# EasyEDA Pro project lune-v6-rev3.2.eprj, schematic lune-v6-rev3.2

## Sheets
1 Connectors: Board Name: lune-v6-rev3.2; Create Date: 2026-08-11; Page Name: Connectors; Project Name: lune-v6-rev3.2; Schematic Name: lune-v6-rev3.2; Update Date: 2026-08-26; Company: EasyEDA.com; Page Size: A4; Version: V1.0
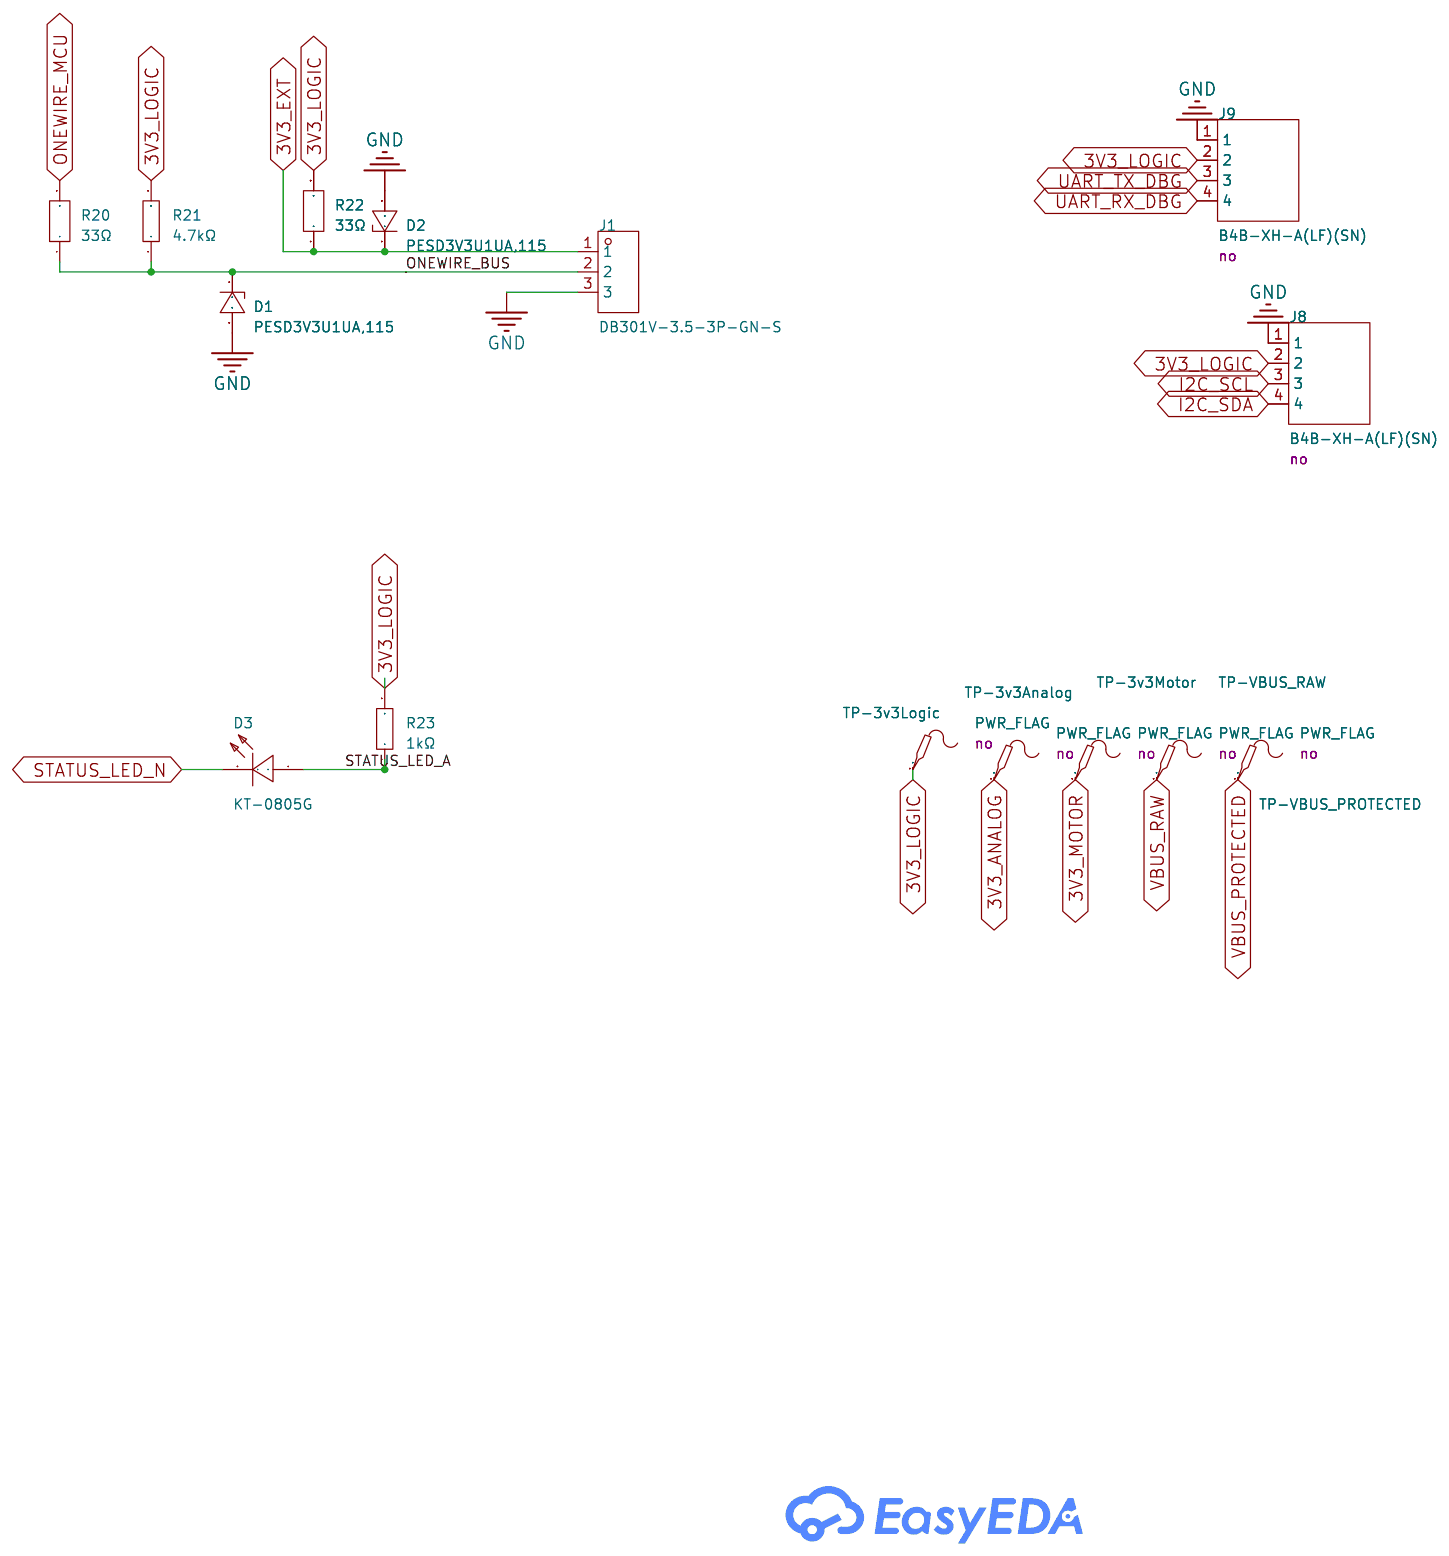
[diagram p0: Connectors]
2 Controller: Page Name: Controller
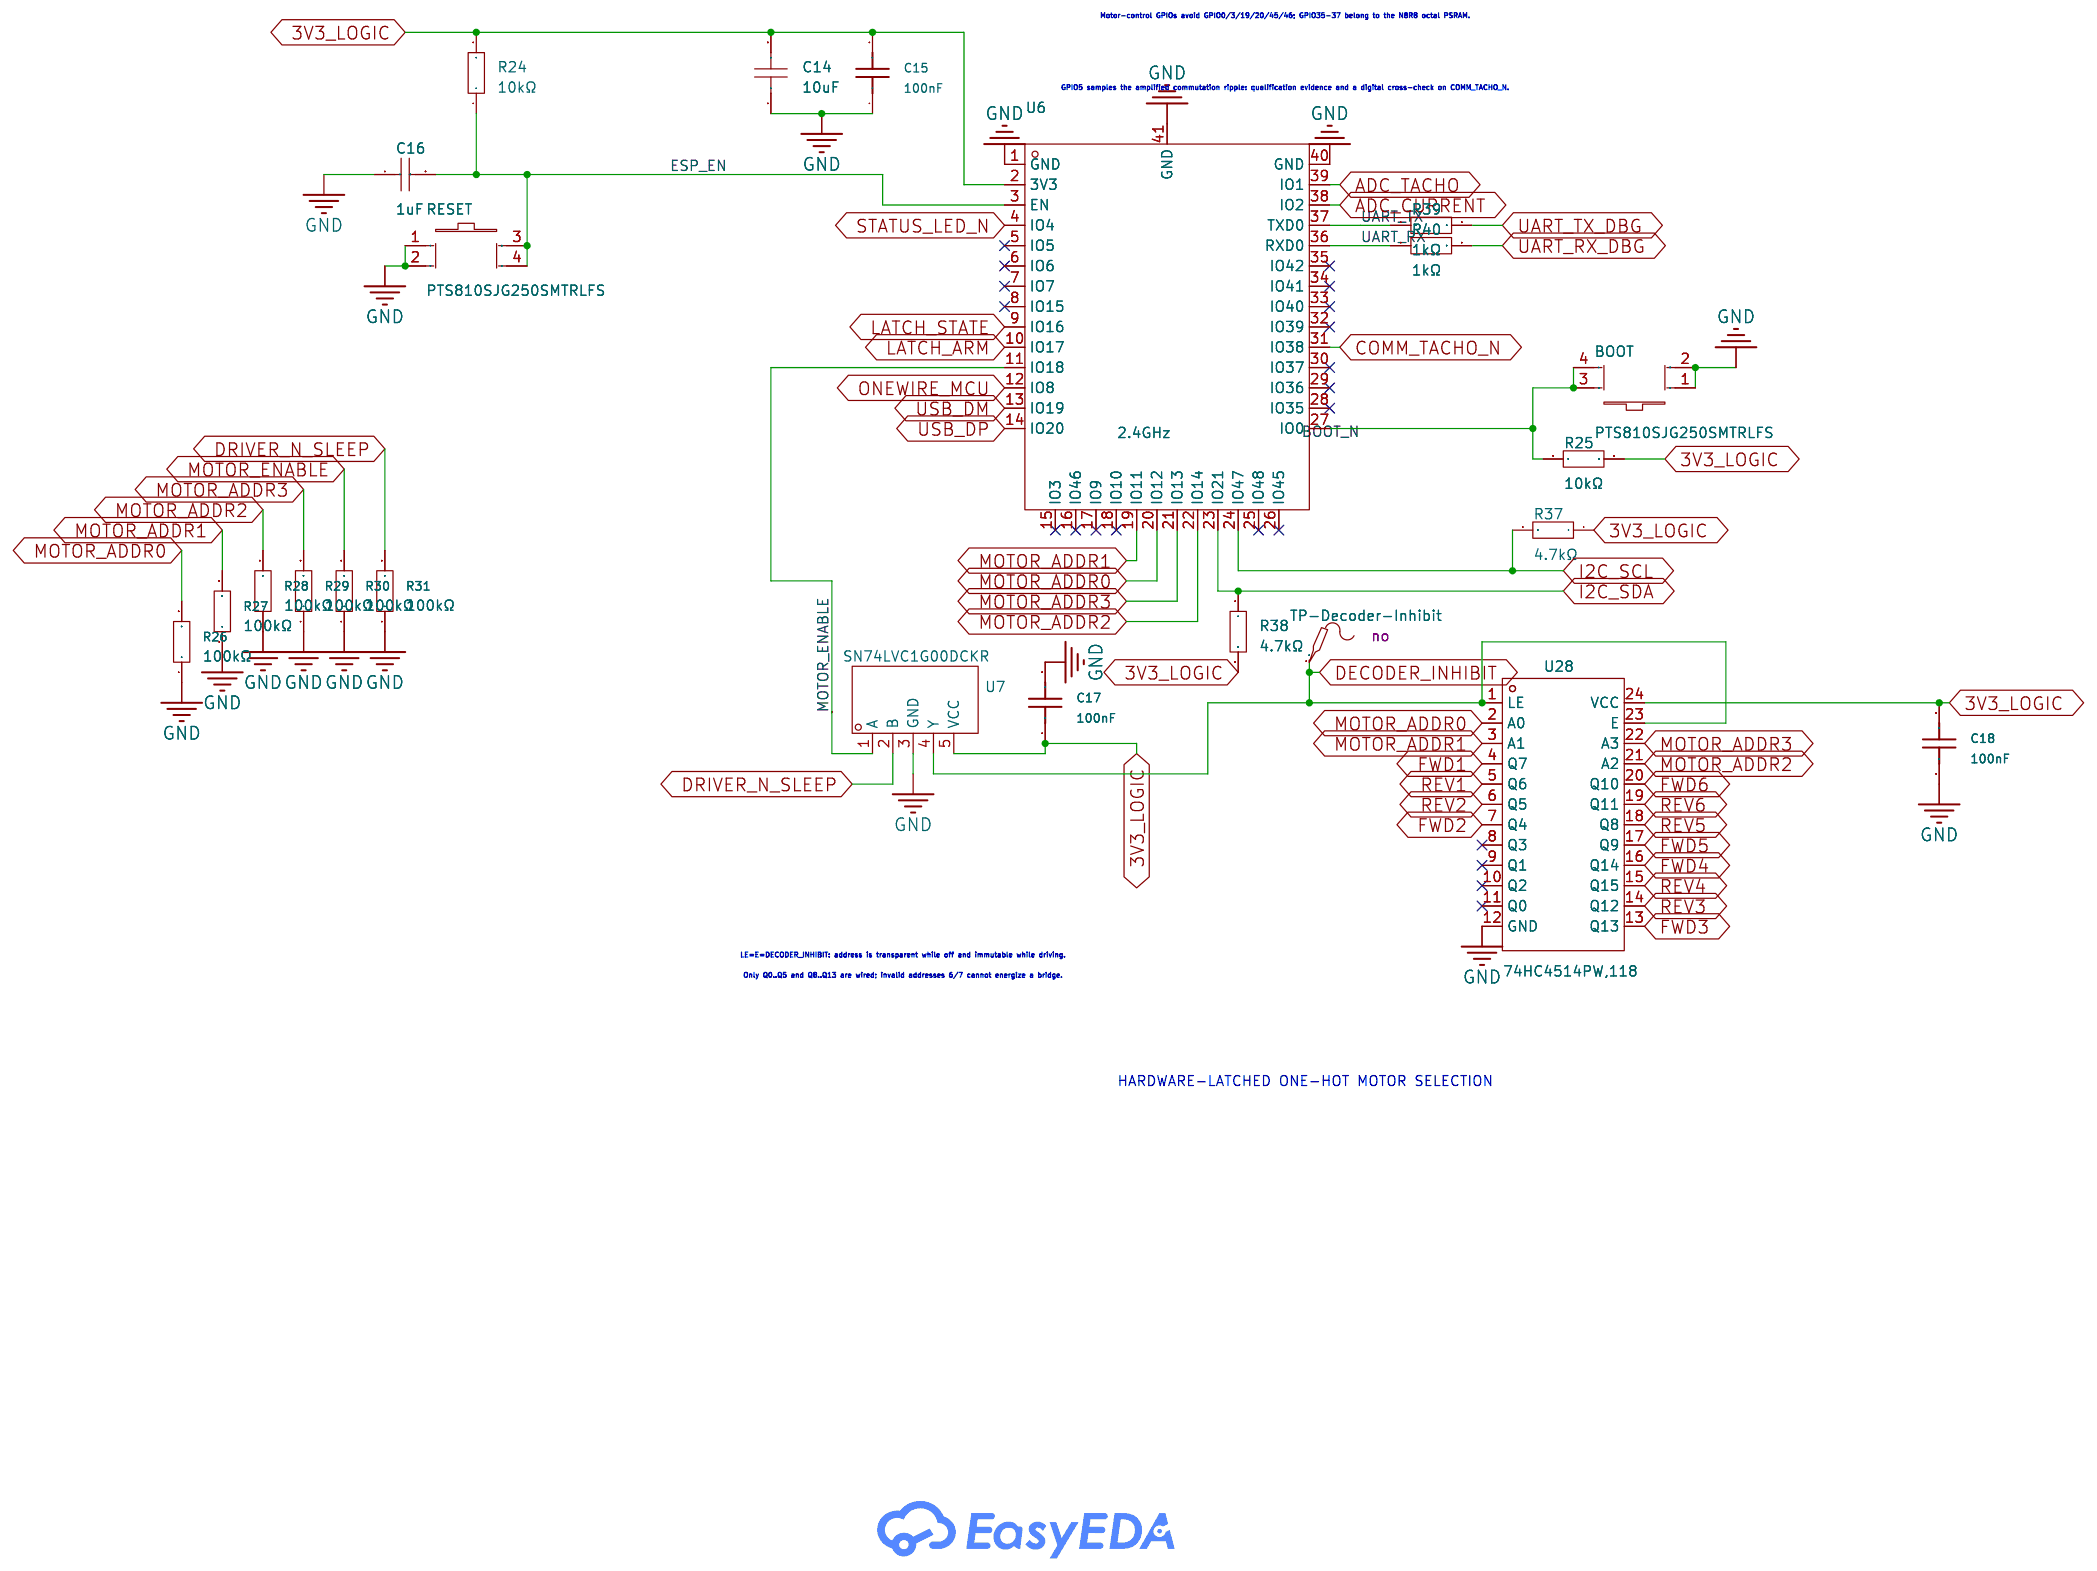
[diagram p1: Controller]
3 Motors: Page Name: Motors; Update Date: 2026-08-20
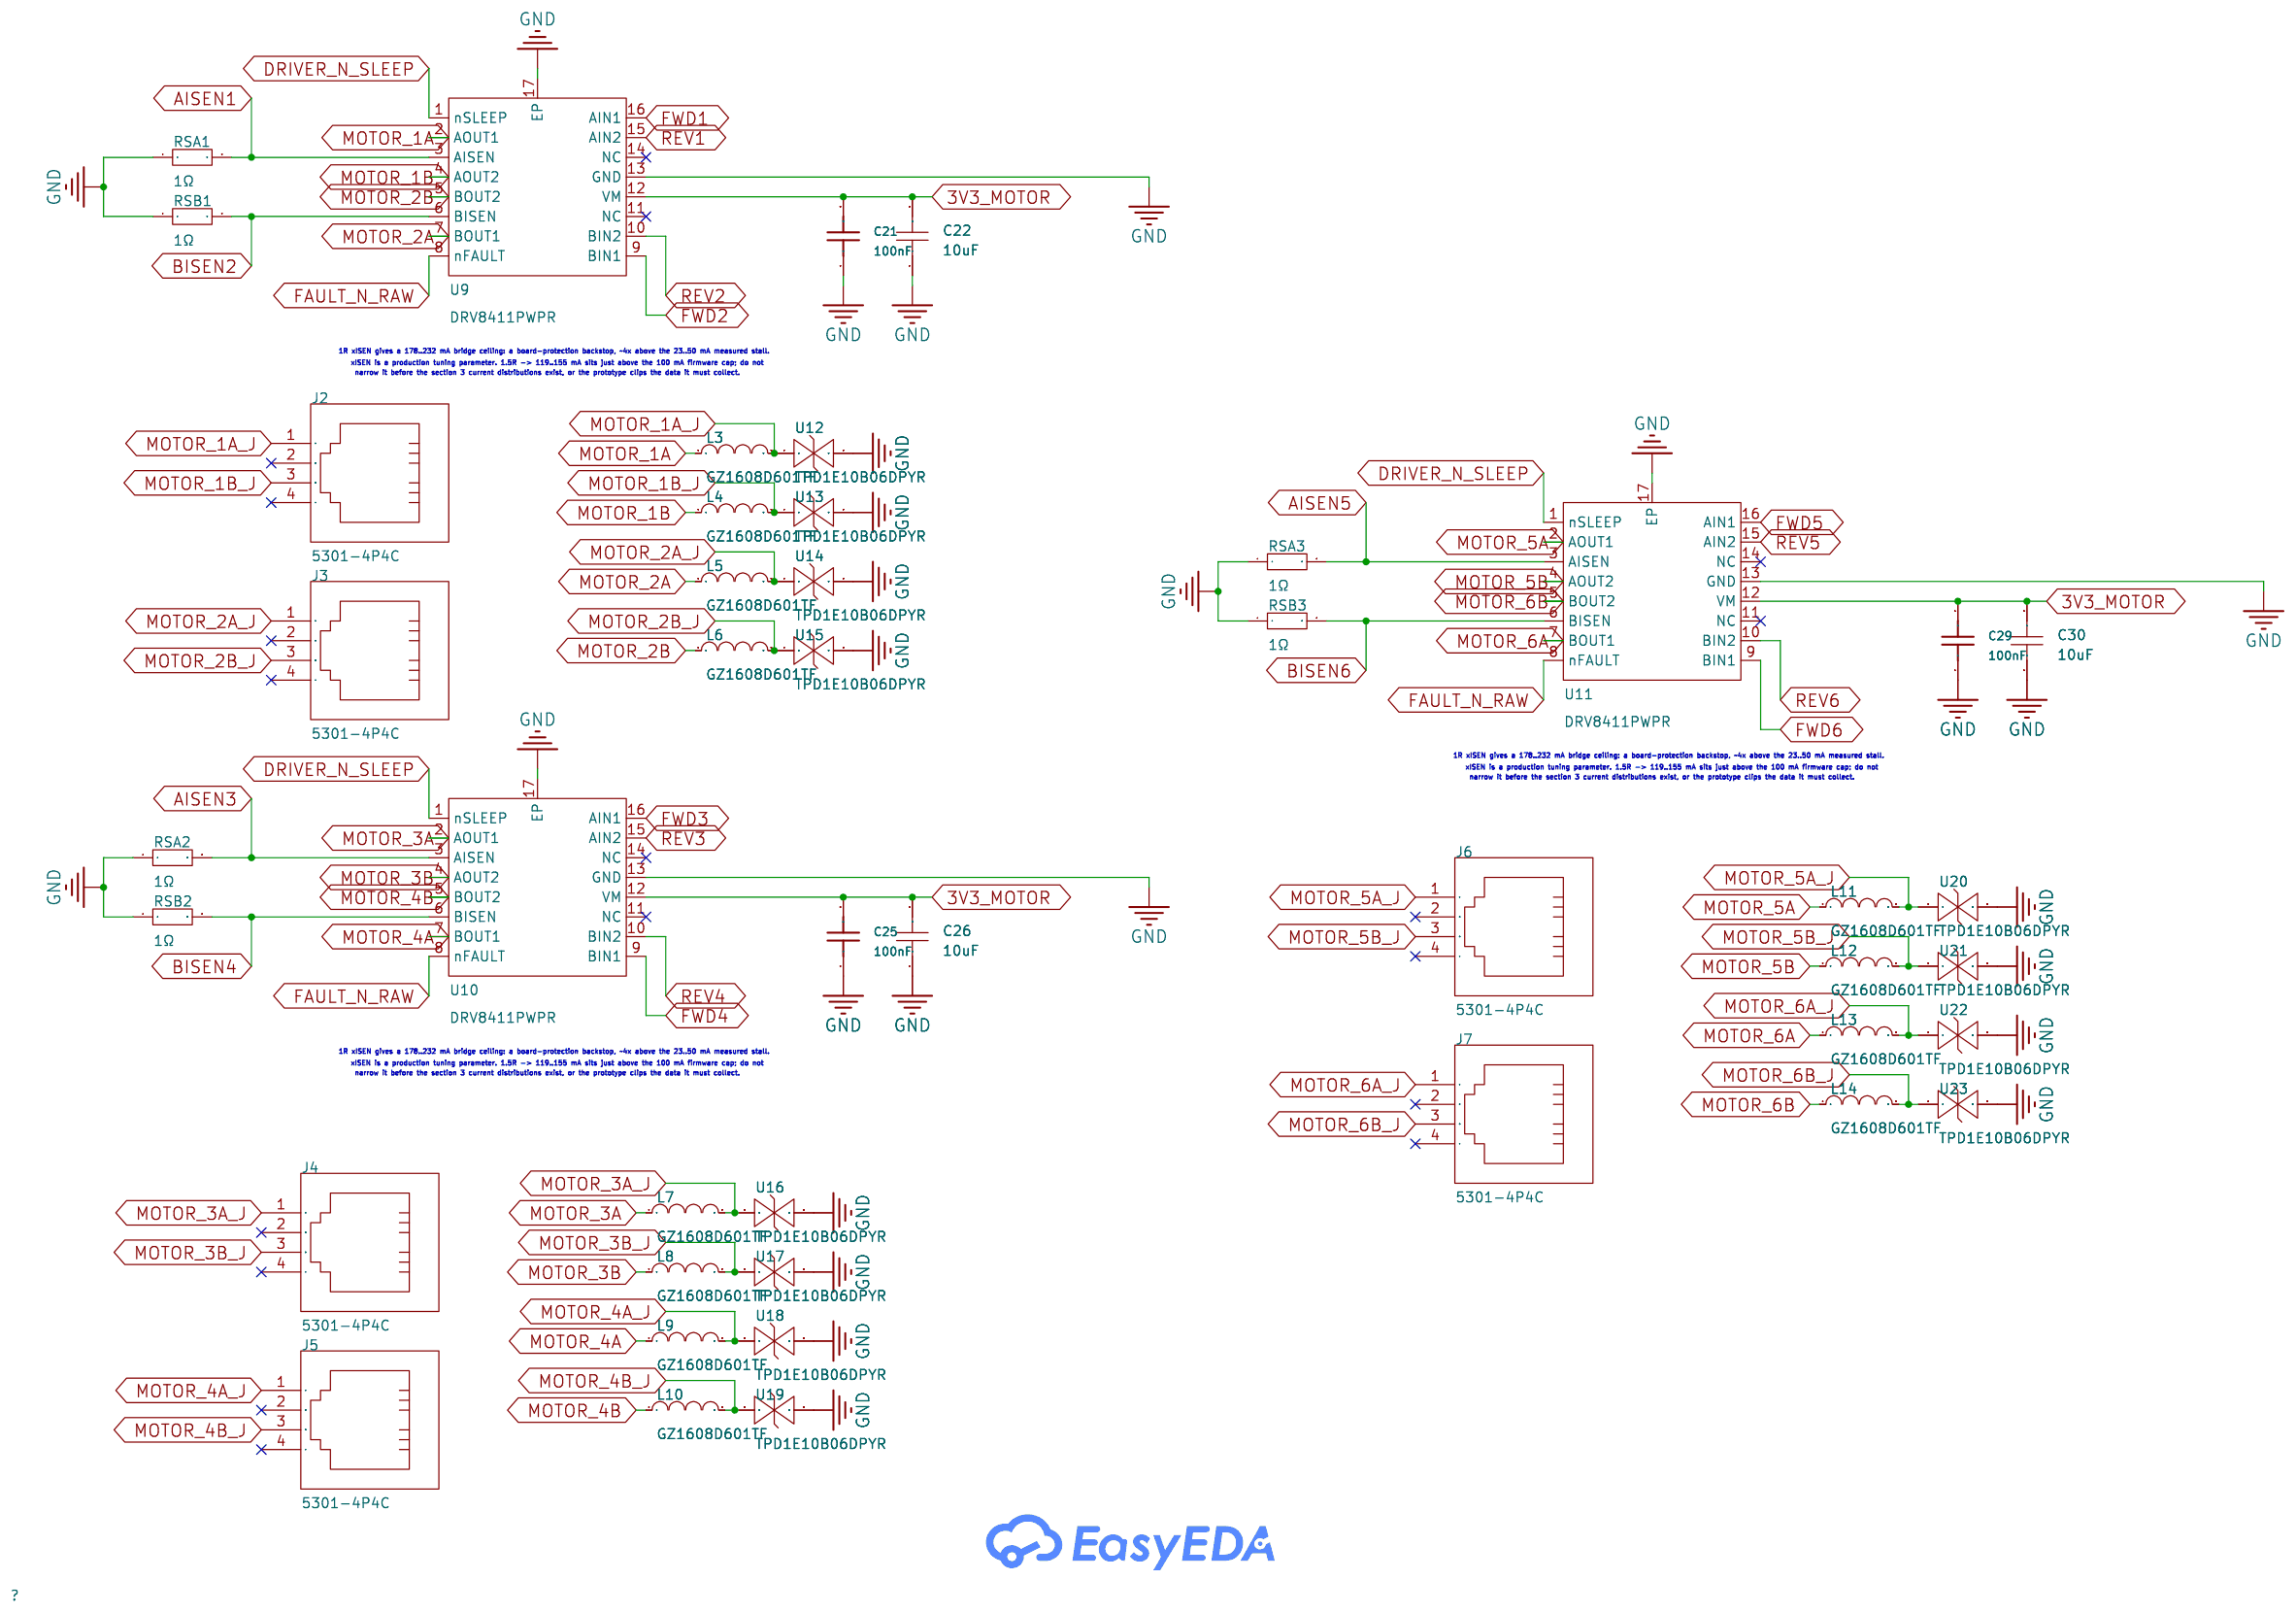
[diagram p2: Motors]
4 Power: Page Name: Power; Update Date: 2026-08-19
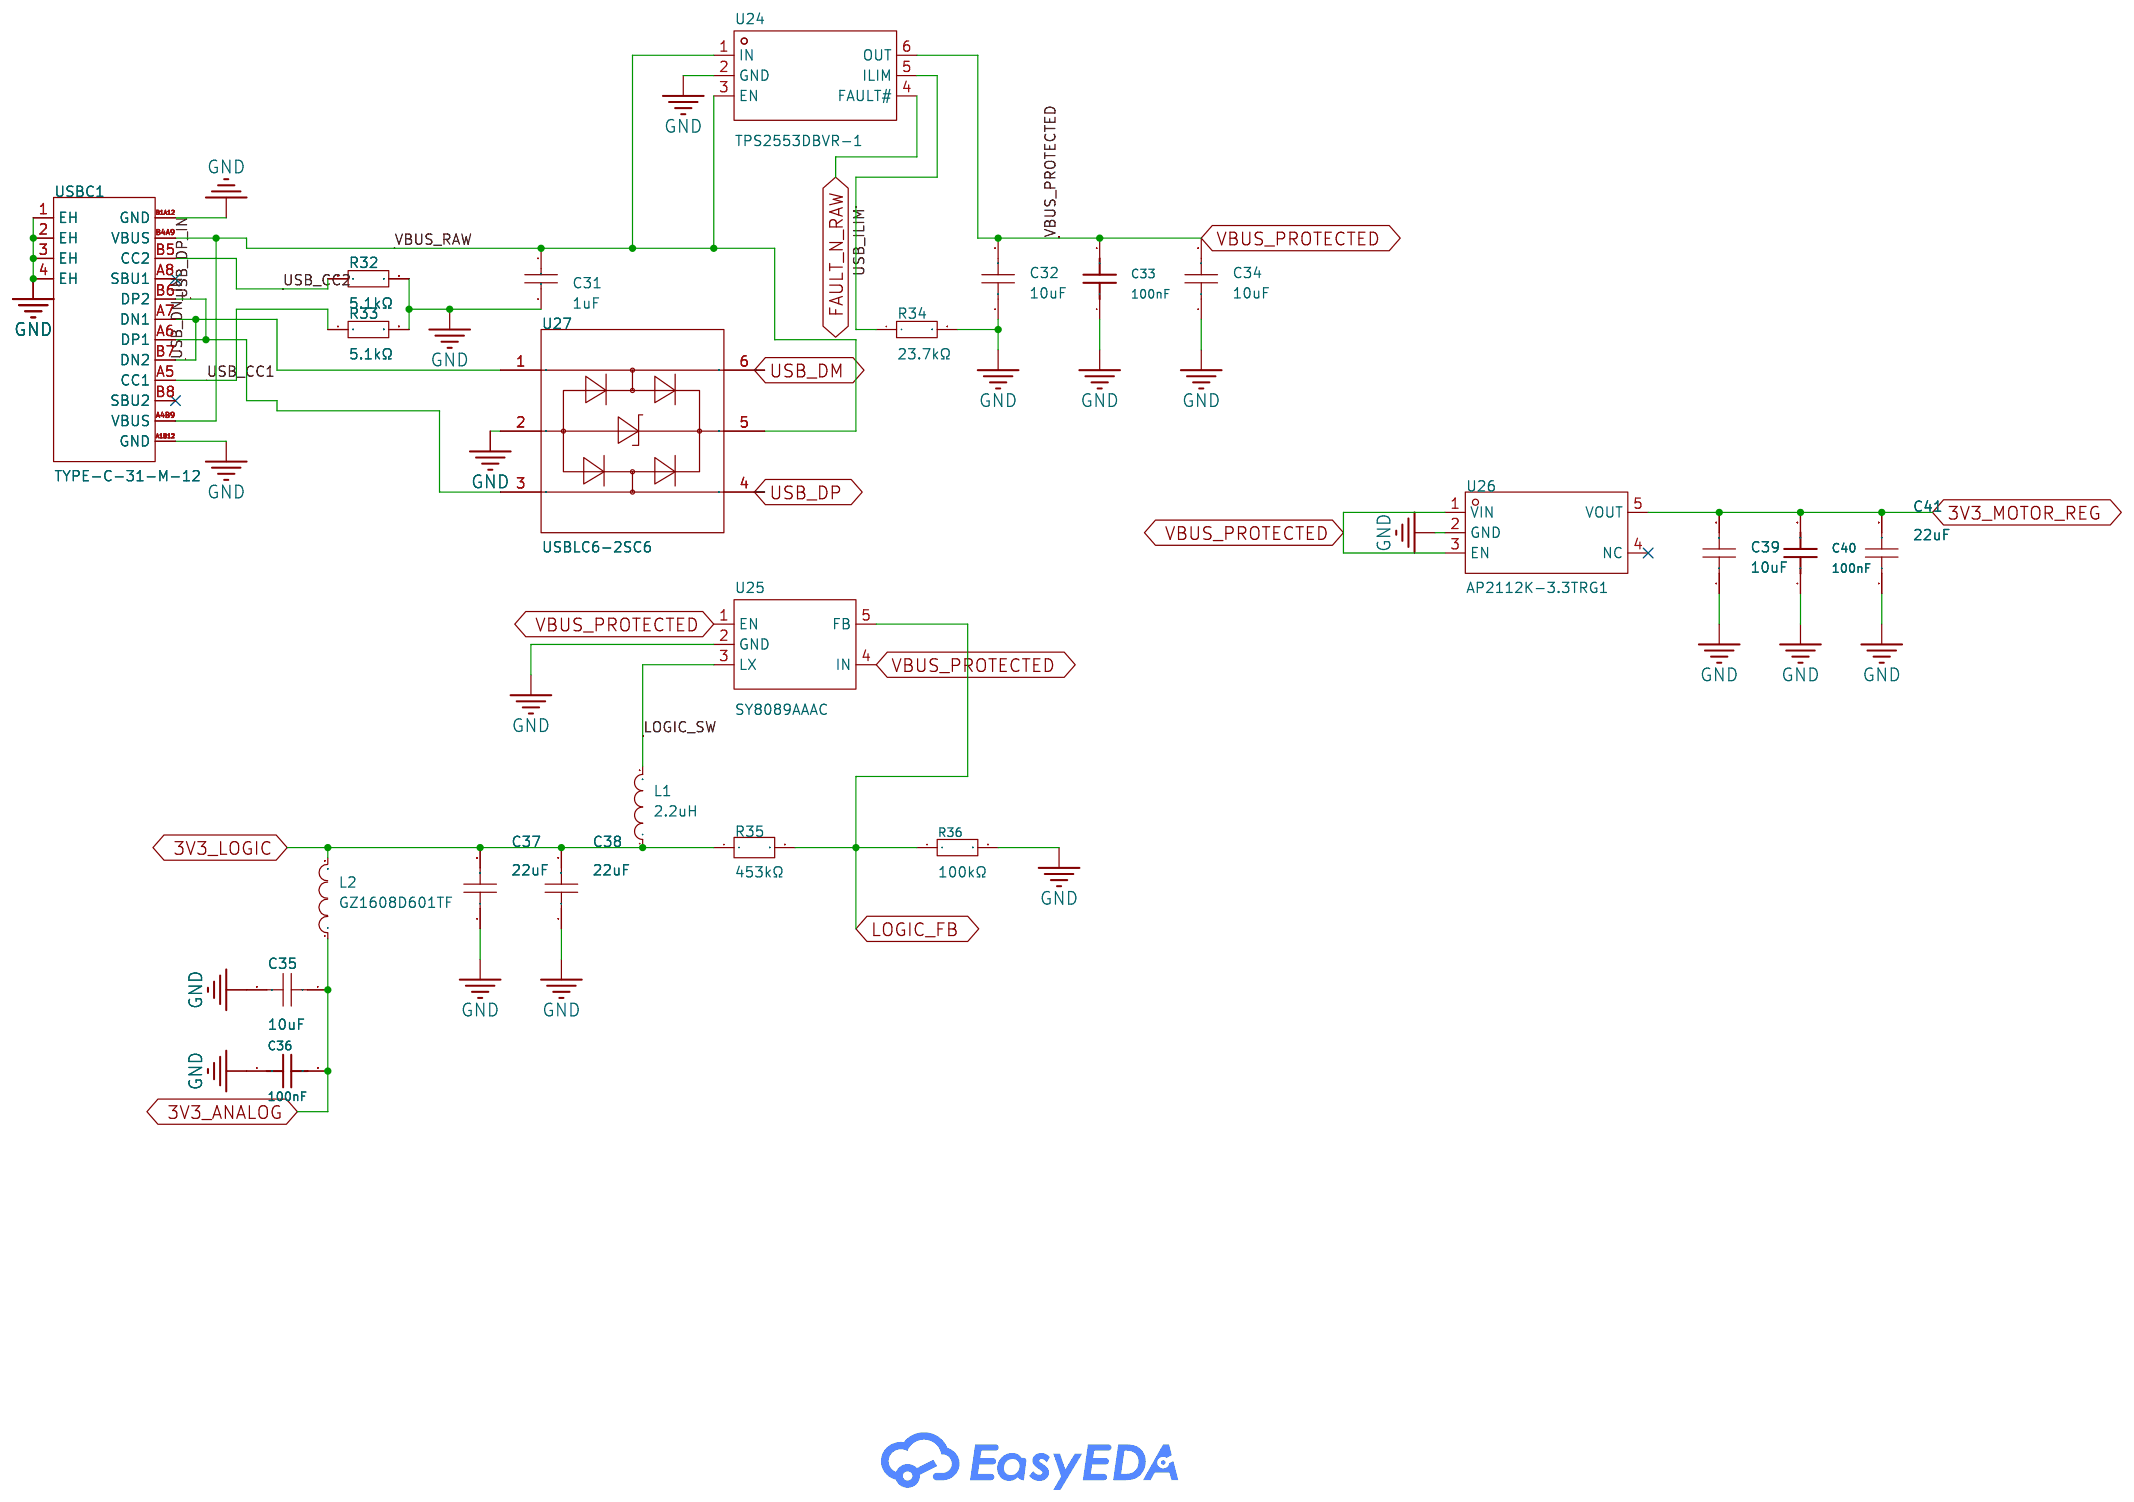
[diagram p3: Power]
5 Analog: Create Date: 2026-08-19; Page Name: Analog; Update Date: 2026-08-27
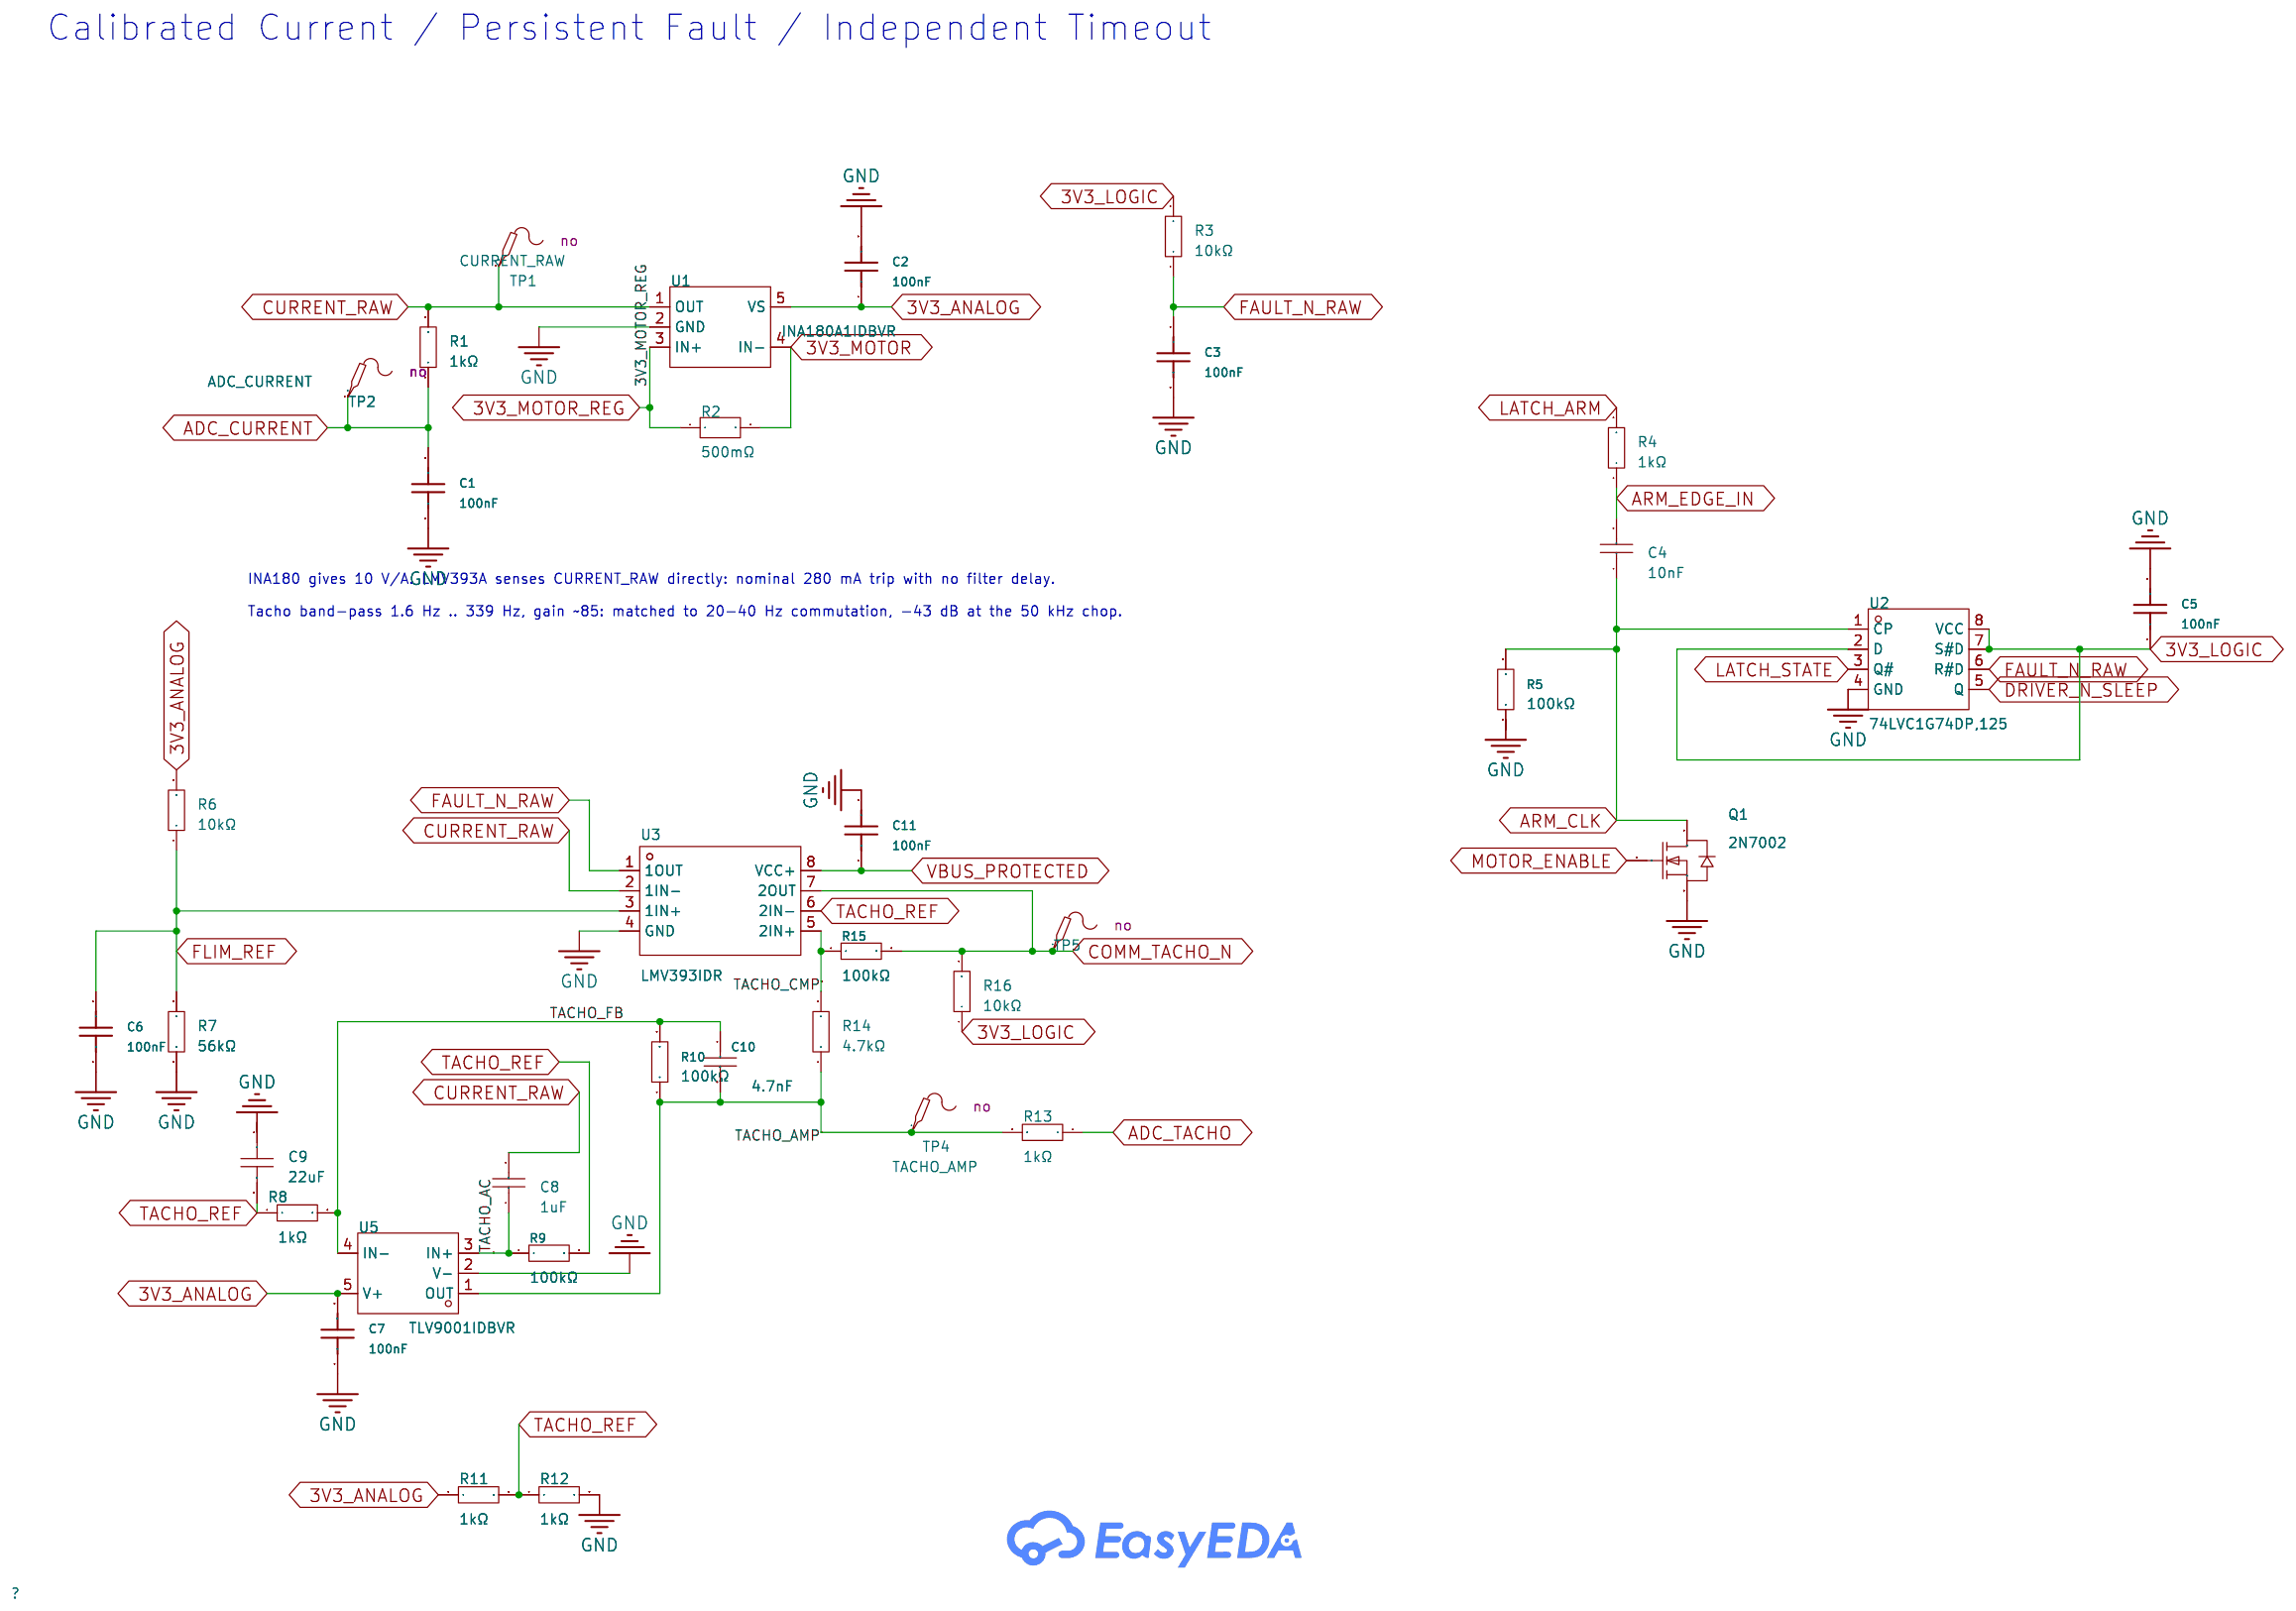
[diagram p4: Analog]

## Parts
sheet Analog
C1  100nF  [C0603]
C2  100nF  [C0603]
C3  100nF  [C0603]
C4  10nF  [C0603]
C5  100nF  [C0603]
C6  100nF  [C0603]
C7  100nF  [C0603]
C8  1uF  [C0603]
C9  22uF  [C0805]
C10  4.7nF  [C0603]
C11  100nF  [C0603]
Q1  2N7002  [SOT-23-3_L2.9-W1.3-P1.90-LS2.4-BR]
R1  1kΩ  [R0603]
R2  500mΩ  [R1206]
R3  10kΩ  [R0603]
R4  1kΩ  [R0603]
R5  100kΩ  [R0603]
R6  10kΩ  [R0603]
R7  56kΩ  [R0603]
R8  1kΩ  [R0603]
R9  100kΩ  [R0603]
R10  100kΩ  [R0603]
R11  1kΩ  [R0603]
R12  1kΩ  [R0603]
R13  1kΩ  [R0603]
R14  4.7kΩ  [R0603]
R15  100kΩ  [R0603]
R16  10kΩ  [R0603]
TP1  CURRENT_RAW  [Test-Point-0.5mm]  (no BOM)
TP2  ADC_CURRENT  [Test-Point-0.5mm]  (no BOM)
TP4  TACHO_AMP  [Test-Point-0.5mm]  (no BOM)
TP5  -  [Test-Point-0.5mm]  (no BOM)
U1  INA180A1IDBVR  [SOT-23-5_L3.0-W1.7-P0.95-LS2.8-BR]
U2  74LVC1G74DP,125  [TSSOP-8_L3.0-W3.0-P0.65-LS4.0-BL]
U3  LMV393IDR  [SOIC-8_L5.0-W4.0-P1.27-LS6.0-BL]
U5  TLV9001IDBVR  [SOT-23-5_L3.0-W1.7-P0.95-LS2.8-BR]
sheet Connectors
D1  PESD3V3U1UA,115  [SOD-323_L1.7-W1.3-LS2.5-RD]
D2  PESD3V3U1UA,115  [SOD-323_L1.7-W1.3-LS2.5-RD]
D3  KT-0805G  [LED0805-R-RD]
J1  DB301V-3.5-3P-GN-S  [CONN-TH_DB301V-3.5-3P-GN]
J8  B4B-XH-A(LF)(SN)  [CONN-TH_B4B-XH-A-LF-SN]  (no BOM)
J9  B4B-XH-A(LF)(SN)  [CONN-TH_B4B-XH-A-LF-SN]  (no BOM)
R20  33Ω  [R0603]
R21  4.7kΩ  [R0603]
R22  33Ω  [R0603]
R23  1kΩ  [R0603]
TP-3v3Analog  PWR_FLAG  [Test-Point-0.5mm]  (no BOM)
TP-3v3Logic  PWR_FLAG  [Test-Point-0.5mm]  (no BOM)
TP-3v3Motor  PWR_FLAG  [Test-Point-0.5mm]  (no BOM)
TP-VBUS_PROTECTED  PWR_FLAG  [Test-Point-0.5mm]  (no BOM)
TP-VBUS_RAW  PWR_FLAG  [Test-Point-0.5mm]  (no BOM)
sheet Controller
BOOT  PTS810SJG250SMTRLFS  [SW-SMD_4P_PTS810SJM250SMTRLFS]
C14  10uF  [C0603]
C15  100nF  [C0603]
C16  1uF  [C0603]
C17  100nF  [C0603]
C18  100nF  [C0603]
R24  10kΩ  [R0603]
R25  10kΩ  [R0603]
R26  100kΩ  [R0603]
R27  100kΩ  [R0603]
R28  100kΩ  [R0603]
R29  100kΩ  [R0603]
R30  100kΩ  [R0603]
R31  100kΩ  [R0603]
R37  4.7kΩ  [R0603]
R38  4.7kΩ  [R0603]
R39  1kΩ  [R0603]
R40  1kΩ  [R0603]
RESET  PTS810SJG250SMTRLFS  [SW-SMD_4P_PTS810SJM250SMTRLFS]
TP-Decoder-Inhibit  -  [Test-Point-0.5mm]  (no BOM)
U6  2.4GHz  [WIRELM-SMD_ESP32-S3-WROOM-1]
U7  SN74LVC1G00DCKR  [SOT-353_L2.1-W1.3-P0.65-LS2.3-BR]
U28  74HC4514PW,118  [TSSOP-24_L7.8-W4.4-P0.65-LS6.4-BL]
sheet Motors
C21  100nF  [C0603]
C22  10uF  [C0603]
C25  100nF  [C0603]
C26  10uF  [C0603]
C29  100nF  [C0603]
C30  10uF  [C0603]
J2  5301-4P4C  [RJ11-TH_RJ11-4P4C]
J3  5301-4P4C  [RJ11-TH_RJ11-4P4C]
J4  5301-4P4C  [RJ11-TH_RJ11-4P4C]
J5  5301-4P4C  [RJ11-TH_RJ11-4P4C]
J6  5301-4P4C  [RJ11-TH_RJ11-4P4C]
J7  5301-4P4C  [RJ11-TH_RJ11-4P4C]
L3  GZ1608D601TF  [L0603]
L4  GZ1608D601TF  [L0603]
L5  GZ1608D601TF  [L0603]
L6  GZ1608D601TF  [L0603]
L7  GZ1608D601TF  [L0603]
L8  GZ1608D601TF  [L0603]
L9  GZ1608D601TF  [L0603]
L10  GZ1608D601TF  [L0603]
L11  GZ1608D601TF  [L0603]
L12  GZ1608D601TF  [L0603]
L13  GZ1608D601TF  [L0603]
L14  GZ1608D601TF  [L0603]
RSA1  1Ω  [R0603]
RSA2  1Ω  [R0603]
RSA3  1Ω  [R0603]
RSB1  1Ω  [R0603]
RSB2  1Ω  [R0603]
RSB3  1Ω  [R0603]
U9  DRV8411PWPR  [HTSSOP-16_L5.0-W4.4-P0.65-LS6.4-TL-EP-1]
U10  DRV8411PWPR  [HTSSOP-16_L5.0-W4.4-P0.65-LS6.4-TL-EP-1]
U11  DRV8411PWPR  [HTSSOP-16_L5.0-W4.4-P0.65-LS6.4-TL-EP-1]
U12  TPD1E10B06DPYR  [X1SON-2_L1.0-W0.6-P0.65-BI-1]
U13  TPD1E10B06DPYR  [X1SON-2_L1.0-W0.6-P0.65-BI-1]
U14  TPD1E10B06DPYR  [X1SON-2_L1.0-W0.6-P0.65-BI-1]
U15  TPD1E10B06DPYR  [X1SON-2_L1.0-W0.6-P0.65-BI-1]
U16  TPD1E10B06DPYR  [X1SON-2_L1.0-W0.6-P0.65-BI-1]
U17  TPD1E10B06DPYR  [X1SON-2_L1.0-W0.6-P0.65-BI-1]
U18  TPD1E10B06DPYR  [X1SON-2_L1.0-W0.6-P0.65-BI-1]
U19  TPD1E10B06DPYR  [X1SON-2_L1.0-W0.6-P0.65-BI-1]
U20  TPD1E10B06DPYR  [X1SON-2_L1.0-W0.6-P0.65-BI-1]
U21  TPD1E10B06DPYR  [X1SON-2_L1.0-W0.6-P0.65-BI-1]
U22  TPD1E10B06DPYR  [X1SON-2_L1.0-W0.6-P0.65-BI-1]
U23  TPD1E10B06DPYR  [X1SON-2_L1.0-W0.6-P0.65-BI-1]
sheet Power
C31  1uF  [C0603]
C32  10uF  [C0603]
C33  100nF  [C0603]
C34  10uF  [C0603]
C35  10uF  [C0603]
C36  100nF  [C0603]
C37  22uF  [C0805]
C38  22uF  [C0805]
C39  10uF  [C0603]
C40  100nF  [C0603]
C41  22uF  [C0805]
L1  2.2uH  [IND-SMD_L4.0-W4.0]
L2  GZ1608D601TF  [L0603]
R32  5.1kΩ  [R0603]
R33  5.1kΩ  [R0603]
R34  23.7kΩ  [R0603]
R35  453kΩ  [R0603]
R36  100kΩ  [R0603]
U24  TPS2553DBVR-1  [SOT-23-6_L2.9-W1.6-P0.95-LS2.8-BL]
U25  SY8089AAAC  [SOT-23-5_L3.0-W1.7-P0.95-LS2.8-BR]
U26  AP2112K-3.3TRG1  [SOT-25-5_L2.9-W1.6-P0.95-LS2.8-BL]
U27  USBLC6-2SC6  [SOT-23-6_L2.9-W1.6-P0.95-LS2.8-BL]
USBC1  TYPE-C-31-M-12  [USB-C_SMD-TYPE-C-31-M-12_1]

## Library data of the parts
C1-C3 C5-C7 C11 C15 C17 C18 C21 C25 C29 C33 C36 C40 = CC0603KRX7R9BB104: LCSC Part Name: 100nF ±10% 50V; Supplier Part: C14663; Manufacturer: YAGEO(国巨); Supplier Footprint: 0603; Datasheet: https://item.szlcsc.com/datasheet/CC0603KRX7R9BB104/15331.html; Supplier: LCSC; Tolerance: ±10%; Voltage Rating: 50V; Temperature Coefficient: X7R
C4 = CL10B103KB8NNNC: LCSC Part Name: 10nF ±10% 50V; Supplier Part: C1589; Manufacturer: SAMSUNG(三星); Supplier Footprint: 0603; Datasheet: https://item.szlcsc.com/datasheet/CL10B103KB8NNNC/1941.html; Supplier: LCSC; Tolerance: ±10%; Voltage Rating: 50V; Temperature Coefficient: X7R
C8 C16 C31 = 0603B105K160CT: LCSC Part Name: 1uF ±10% 16V; Supplier Part: C108463; Manufacturer: Walsin(华新科); Supplier Footprint: 0603; Datasheet: https://item.szlcsc.com/datasheet/0603B105K160CT/109682.html; Supplier: LCSC; Tolerance: ±10%; Voltage Rating: 16V; Temperature Coefficient: X7R
C9 C37 C38 C41 = TCC0805X5R226K6R3FT: LCSC Part Name: 22uF ±10% 6.3V; Supplier Part: C380337; Manufacturer: CCTC(三环); Supplier Footprint: 0805; JLCPCB Part Class: Extended Part; Datasheet: https://item.szlcsc.com/datasheet/TCC0805X5R226K6R3FT/352742.html; Supplier: LCSC; Tolerance: ±10%; Voltage Rating: 6.3V; Temperature Coefficient: X5R
C10 = CC0603KRX7R9BB472: LCSC Part Name: 4.7nF ±10% 50V; Supplier Part: C106218; Manufacturer: YAGEO(国巨); Supplier Footprint: 0603; Datasheet: https://item.szlcsc.com/datasheet/CC0603KRX7R9BB472/107433.html; Supplier: LCSC; Tolerance: ±10%; Voltage Rating: 50V; Temperature Coefficient: X7R
Q1 = 2N7002_C8545: LCSC Part Name: 1个N沟道 耐压:60V 电流:115mA; Supplier Part: C8545; Manufacturer: CJ(江苏长电/长晶); Supplier Footprint: SOT-23; Datasheet: https://item.szlcsc.com/datasheet/2N7002/9040.html; Supplier: LCSC; Number: 1 N-channel; Drain to Source Voltage: 60V; Current - Continuous Drain(Id): 115mA; RDS(on): 5Ω@10V; Pd - Power Dissipation: 225mW; Gate Threshold Voltage (Vgs(th)): 2.5V; Input Capacitance(Ciss): 50pF; Reverse Transfer Capacitance (Crss@Vds): 5pF; Type: N-Channel; Output Capacitance(Coss): 25pF; Vgs: ±20V
R1 R4 R8 R11-R13 R23 R39 R40 = RC0603FR-071KL: LCSC Part Name: 厚膜电阻 1kΩ ±1% 100mW; Supplier Part: C22548; Manufacturer: YAGEO(国巨); Supplier Footprint: 0603; JLCPCB Part Class: Extended Part; Datasheet: https://item.szlcsc.com/datasheet/RC0603FR-071KL/23274.html; Supplier: LCSC; Type: Thick Film Resistor; Tolerance: ±1%; Power(Watts): 100mW; Voltage-Supply(Max): 75V; Temperature Coefficient: ±100ppm/℃; Operating Temperature: -55℃~+155℃
R2 = HoYH1206-1W-500mR-1%: LCSC Part Name: 500mΩ ±1% 1W; Supplier Part: C601092; Manufacturer: Milliohm(毫欧); Supplier Footprint: 1206; Datasheet: https://item.szlcsc.com/datasheet/HoYH1206-1W-500mR-1%2525/630297.html; Supplier: LCSC; Type: Current Sense Resistor; Tolerance: ±1%; Power(Watts): 1W; Temperature Coefficient: ±100ppm/℃; Mounting Type: Surface Mount
R3 R6 R16 R24 R25 = RC0603FR-0710KL: LCSC Part Name: 厚膜电阻 10kΩ ±1% 100mW; Supplier Part: C98220; Manufacturer: YAGEO(国巨); Supplier Footprint: 0603; Datasheet: https://item.szlcsc.com/datasheet/RC0603FR-0710KL/99429.html; Supplier: LCSC; Type: Thick Film Resistor; Tolerance: ±1%; Power(Watts): 100mW; Voltage-Supply(Max): 75V; Temperature Coefficient: ±100ppm/℃; Operating Temperature: -55℃~+155℃
R5 R9 R10 R15 R26-R31 R36 = RC0603FR-07100KL: LCSC Part Name: 厚膜电阻 100kΩ ±1% 100mW; Supplier Part: C14675; Manufacturer: YAGEO(国巨); Supplier Footprint: 0603; Datasheet: https://item.szlcsc.com/datasheet/RC0603FR-07100KL/15343.html; Supplier: LCSC; Type: Thick Film Resistor; Tolerance: ±1%; Power(Watts): 100mW; Voltage-Supply(Max): 75V; Temperature Coefficient: ±100ppm/℃; Operating Temperature: -55℃~+155℃
R7 = RC0603FR-0756KL: LCSC Part Name: 厚膜电阻 56kΩ ±1% 100mW; Supplier Part: C114630; Manufacturer: YAGEO(国巨); Supplier Footprint: 0603; Datasheet: https://atta.szlcsc.com/upload/public/pdf/source/20180821/C275644_0D56F95EFF785E7D9A1FEF436B37DA78.pdf; Supplier: LCSC; Type: Thick Film Resistors; Tolerance: ±1%; Temperature Coefficient: ±100ppm/℃; Operating Temperature Range: -55℃~+155℃
R14 R21 R37 R38 = RC0603FR-074K7L: LCSC Part Name: 厚膜电阻 4.7kΩ ±1% 100mW; Supplier Part: C99782; Manufacturer: YAGEO(国巨); Supplier Footprint: 0603; Datasheet: https://item.szlcsc.com/datasheet/RC0603FR-074K7L/100996.html; Supplier: LCSC; Type: Thick Film Resistor; Tolerance: ±1%; Power(Watts): 100mW; Voltage-Supply(Max): 75V; Temperature Coefficient: ±100ppm/℃; Operating Temperature: -55℃~+155℃
TP1 TP2 TP4 TP5 TP-3v3Analog TP-3v3Logic TP-3v3Motor TP-Decoder-Inhibit TP-VBUS_PROTECTED TP-VBUS_RAW = Test-Point
U1 = INA180A1IDBVR: LCSC Part Name: 高低侧电压输出电流检测放大器; Supplier Part: C122228; Manufacturer: TI(德州仪器); Supplier Footprint: SOT-23-5; Datasheet: https://www.ti.com/cn/lit/ds/symlink/ina180.pdf; Supplier: LCSC; Number of Channels: 1; Vcm - Common Mode Voltage: -200mV~26V; Gain: 20V/V; Bandwidth: 350kHz; Ib - Input Bias Current: 100nA; Vos - Input Offset Voltage: 25uV; Operating Temperature: -40℃~+125℃; Differential Voltage: ±26V; Single Supply: 2.7V~5.5V; Quiescent Current: 197uA; Output Current: 8mA; Input Offset Voltage Drift(Vos TC): 1uV/℃; Slew Rate: 2V/us; Common Mode Rejection Ratio (CMRR): 100dB; Noise density(eN): 40nV/√Hz@1kHz; Features: Analog output interface；Enable/shutdown function；High-side detection；Low-side detection
U2 = 74LVC1G74DP,125: LCSC Part Name: 单D型触发器，带置位和复位；正边沿触发; Supplier Part: C458768; Manufacturer: Nexperia(安世); Supplier Footprint: TSSOP-8; Datasheet: https://item.szlcsc.com/datasheet/74LVC1G74DP%252C125/462699.html; Supplier: LCSC; Type: D-Type; Trigger Type: Rising Edge; Voltage - Supply: 1.65V~5.5V; Clock Frequency: 200MHz; Function: Set and Reset; Number of Elements: 1; Number of Bits per Element: 1; Output Type: Complementary type; Propagation Delay: 4.1ns@5V,50pF; Series: 74LVC Series; Current - Output Low(IOL): 32mA; Current - Output High(IOH): 32mA; Quiescent Current: 40uA; Input Capacitance: 4pF; Operating Temperature: -40℃~+125℃; Synchronous/Asynchronous: Asynchronous; Setup Time: 1.1ns; Hold Time: 1ns
U3 = LMV393IDR: LCSC Part Name: 通用低电压比较器; Supplier Part: C7984; Manufacturer: TI(德州仪器); Supplier Footprint: SOIC-8; JLCPCB Part Class: Extended Part; Datasheet: https://www.ti.com/cn/lit/ds/symlink/lmv339.pdf; Supplier: LCSC; Number of Channels: 2; Vos - Input Offset Voltage: 1.7mV; Ib - Input Bias Current: 25nA; Propagation Delay Time: 350ns; Output Type: Open Collector; Output Mode: TTL；CMOS; Quiescent Current: 70uA; Operating Temperature: -40℃~+125℃; Single Supply: 2.7V~5.5V; Input Offset Voltage Drift(Vos TC): 5uV/℃; Input Offset Current(Ios): 5nA
U5 = TLV9001IDBVR: LCSC Part Name: 适用于成本敏感型系统的低功耗、轨到轨输入输出、1MHz 运算放大器; Supplier Part: C398363; Manufacturer: TI(德州仪器); Supplier Footprint: SOT-23-5; JLCPCB Part Class: Extended Part; Datasheet: https://www.ti.com/cn/lit/ds/symlink/tlv9001.pdf; Supplier: LCSC; Number of Channels: 1; Rail to Rail: Rail-to-Rail Input, Rail-to-Rail Output; Gain Bandwidth Product: 1MHz; Vos - Input Offset Voltage: 1.6mV; Input Offset Voltage Drift(Vos TC): 600nV/℃; Slew Rate: 2V/us; Ib - Input Bias Current: 5pA; Input Offset Current(Ios): 2pA; Input Voltage Noise Density: 4.7nV/√Hz@1kHz; Common Mode Rejection Ratio(CMRR): 86dB; Quiescent Current: 60uA; Output Current: 40mA; Operating Temperature: -40℃~+125℃; Single supply: 1.8V~5.5V; Dual Supply: -2.75V~-900mV；900mV~2.75V; Features: Enable/shutdown function；EMI filtering/RF suppression
D1 D2 = PESD3V3U1UA,115: LCSC Part Name: 单向ESD 3.3V截止; Supplier Part: C403915; Manufacturer: Nexperia(安世); Supplier Footprint: SOD-323; JLCPCB Part Class: Extended Part; Datasheet: https://item.szlcsc.com/datasheet/PESD3V3U1UA%252C115/390507.html; Supplier: LCSC; Polarity: Unidirectional; Reverse Stand-Off Voltage (Vrwm): 3.3V; Voltage - Breakdown: 4.5V; Reverse Leakage Current (Ir): 1nA; Number of Channels: 1; level of protection: IEC 61000-4-2; Type: ESD; Junction Capacitance: 2.6pF
D3 = KT-0805G: LCSC Part Name: 0805 翠绿 高亮; Supplier Part: C2297; Manufacturer: KENTO; Supplier Footprint: 0805; JLCPCB Part Class: Basic Part; Datasheet: https://item.szlcsc.com/datasheet/KT-0805G/2670.html; Supplier: LCSC; Lamp Holder Type: 2mm x 1.25mm square LED; Illumination Color: Emerald Green; Voltage - Forward(Vf): 2.6V~3.1V; Power(Watts): 100mW; Forward Current: 5mA; Wavelength - Dominant: 513nm~528nm; Peak Wavelength: 525nm; Diode Configuration: Discrete Diode; Lens Color: Water Clear; Luminous Intensity: 430mcd; Viewing Angle: 120°; Operating Temperature: -40℃~+85℃
J1 = DB301V-3.5-3P-GN-S: LCSC Part Name: 1x3P 3.5mm 直插 排数:1 每排P数:3; Supplier Part: C695630; Manufacturer: DORABO(地博电气); Supplier Footprint: 插件,P=3.5mm; JLCPCB Part Class: Extended Part; Datasheet: https://item.szlcsc.com/datasheet/DB301V-3.5-3P-GN-S/728966.html; Supplier: LCSC; Number of Positions or Pins: 1x3P; Pitch: 3.5mm; Color: Green; Mounting Type: Through Hole; Number of Pins: 3P; Number of Rows: 1; Number of PINs Per Row: 3; Screw Specification: M2; Current Rating: 7A; Voltage Rating (Max): 300V; Wire Gauge - AWG: 18~24; Wire Gauge - mm2: 0.5~1; Operating Temperature: -40℃~+105℃
J8 J9 = B4B-XH-A(LF)(SN): LCSC Part Name: 1x4P 间距:2.5mm 直插 系列:XH; Supplier Part: C144395; Manufacturer: JST; Supplier Footprint: 插件,P=2.5mm; JLCPCB Part Class: Extended Part; Datasheet: https://item.szlcsc.com/datasheet/B4B-XH-A(LF)(SN)/155727.html; Supplier: LCSC; Pins Structure: 1x4P; Pitch: 2.5mm; Mounting Type: Through Hole; Reference Series: XH; Number of Pins: 4P; Number of Rows: 1; Number of PINs Per Row: 4; Current Rating: 3A; Contact Material: Brass; Contact Plating: Tin; Operating Temperature: -25℃~+85℃; Voltage Rating: 250V; Plastic Material: PA66; Flame Retardant Rating: UL94V-0; Supplementary Features: K Pin; Color: White; Z-Height of the Board: 7mm; X-Length of Bottom Edge on Board (Spacing Line): 12.4mm; Y-Width of Bottom Edge on Board: 5.75mm
R20 R22 = CRCW060333R0FKEA: LCSC Part Name: 厚膜电阻 33Ω ±1% 100mW; Supplier Part: C844927; Manufacturer: VISHAY(威世); Supplier Footprint: 0603; JLCPCB Part Class: Extended Part; Datasheet: https://item.szlcsc.com/datasheet/CRCW060333R0FKEA/904501.html; Supplier: LCSC; Type: Thick Film Resistor; Tolerance: ±1%; Power(Watts): 100mW; Voltage-Supply(Max): 75V; Temperature Coefficient: ±100ppm/℃; Operating Temperature: -55℃~+155℃
BOOT RESET = PTS810SJG250SMTRLFS: LCSC Part Name: 轻触开关4.2mm*3.2mm，400gf; Supplier Part: C221895; Manufacturer: C&K; Supplier Footprint: SMD-4P,3.2x4.2mm; JLCPCB Part Class: Extended Part; Datasheet: https://atta.szlcsc.com/upload/public/pdf/source/20180613/C221897_9316320DEFA4333FA0E6C5D565B0D5EA.pdf; Supplier: LCSC; Circuit: SPST; Actuator Style: Round Button; Operating Force: 400gf; Mounting Style: Standing paste; Switch Length: 4.2mm; Switch Width: 3.2mm; Switch Height: 2.5mm; Contact Current: 50mA; Voltage Rating (DC): 16V; Pin Style: J-pin; Operating Temperature: -40℃~+85℃
C14 C22 C26 C30 C32 C34 C35 C39 = TCC0603X5R106K160CT: LCSC Part Name: 10uF ±10% 16V; Supplier Part: C18164635; Manufacturer: CCTC(三环); Supplier Footprint: 0603; Datasheet: https://item.szlcsc.com/datasheet/TCC0603X5R106K160CT/19306428.html; Supplier: LCSC; Tolerance: ±10%; Voltage Rating: 16V; Temperature Coefficient: X5R
U6 = ESP32-S3-WROOM-1-N8R8: LCSC Part Name: 不带固件 2.4GHz Wi-Fi (802.11b/g/n) + 蓝牙 5 (LE) 模组; Supplier Part: C2913201; Manufacturer: ESPRESSIF(乐鑫); Supplier Footprint: SMD,25.5x18mm; JLCPCB Part Class: Extended Part; Datasheet: https://item.szlcsc.com/datasheet/ESP32-S3-WROOM-1-N8R8/3198299.html; Supplier: LCSC; Utilized IC / Part: ESP32-S3R8; Wireless Standard: Bluetooth5.0; Interface Type: I2C；GPIO；UART；SPI；USB；I2S; Antenna Type: On-board PCB Antenna; Output Power: 20.5dBm; Voltage - Supply: 3V~3.6V; Receive  Current: 97mA; Send  Current: 330mA; Sensitivity: -104.5dBm; Operating Temperature: -40℃~+65℃
U7 = SN74LVC1G00DCKR: LCSC Part Name: 单路2输入正与非门; Supplier Part: C8185; Manufacturer: TI(德州仪器); Supplier Footprint: SOT-353; JLCPCB Part Class: Extended Part; Datasheet: https://www.ti.com/cn/lit/ds/symlink/sn74lvc1g00.pdf; Supplier: LCSC; Logic Type: NAND Gate; Number of Channels: 1; Voltage - Supply: 1.65V~5.5V; Quiescent Current: 10uA; Current - Output Low(IOL): 32mA; Current - Output High(IOH): 32mA; Input Logic Level - High: 1.7V~2V; Input Logic Level - Low: 700mV~800mV; Output Logic Level - High: 1.9V；2.4V；2.3V；1.2V；3.8V; Output Logic Level - Low: 550mV；400mV；300mV；450mV; Series: 74LVC Series; Propagation Delay: 4.3ns@5V,50pF; Operating Temperature: -40℃~+125℃; Input Number: 2; Features: Local shutdown mode；Overvoltage-tolerant input；Live insertion protection；Rear drive protection
U28 = 74HC4514PW,118: Supplier Part: C58910; Manufacturer: Nexperia(安世); Supplier Footprint: TSSOP-24; JLCPCB Part Class: Extended Part; Datasheet: https://item.szlcsc.com/datasheet/74HC4514PW%252C118/59955.html; Supplier: LCSC; Type: Decoder; Voltage Supply Source: Single Supply; Voltage - Supply: 2V~6V; Current - Output Low(IOL): 5.2mA; Current - Output High(IOH): 5.2mA; Operating temperature: -40℃~+125℃; Propagation Delay: 27ns@4.5V,50pF; Quiescent Current: 8uA
J2-J7 = 5301-4P4C: LCSC Part Name: 弯插 不带LED; Supplier Part: C3097715; Manufacturer: EVERCOM(恒连); Supplier Footprint: 弯插; JLCPCB Part Class: Extended Part; Datasheet: https://item.szlcsc.com/datasheet/5301-4P4C/3657110.html; Supplier: LCSC; Connector Type: RJ11 Jack; Mounting Type: Right Angle; Number of Ports: 1; LED: Non-LED; Shielding: Unshielded; PoE: Non-PoE; Supplementary Features: Harpoon Contact (Plastic); Contact Material: Phosphor Bronze; Contact Plating: Gold; Operating Temperature: -40℃~+85℃
L2-L14 = GZ1608D601TF: LCSC Part Name: 单路 0603磁珠 阻抗600Ω@100MHz; Supplier Part: C1002; Manufacturer: Sunlord(顺络); Supplier Footprint: 0603; JLCPCB Part Class: Basic Part; Datasheet: https://item.szlcsc.com/datasheet/GZ1608D601TF/1354.html; Supplier: LCSC; Impedance @ Frequency: 600Ω@100MHz; Tolerance: ±25%; DC Resistance(DCR): 450mΩ; Current Rating: 200mA; Number of Circuits: 1; Operating Temperature: -55℃~+125℃
RSA1-RSA3 RSB1-RSB3 = RC0603FR-071RL: LCSC Part Name: 厚膜电阻 1Ω ±1% 100mW; Supplier Part: C112305; Manufacturer: YAGEO(国巨); Supplier Footprint: 0603; JLCPCB Part Class: Extended Part; Datasheet: https://item.szlcsc.com/datasheet/RC0603FR-071RL/113537.html; Supplier: LCSC; Type: Thick Film Resistor; Tolerance: ±1%; Power(Watts): 100mW; Voltage-Supply(Max): 75V; Temperature Coefficient: ±200ppm/℃; Operating Temperature: -55℃~+155℃
U9-U11 = DRV8411PWPR: Supplier Part: C18212622; Manufacturer: TI(德州仪器); Supplier Footprint: HTSSOP-16; JLCPCB Part Class: Extended Part; Datasheet: https://www.ti.com/lit/gpn/drv8411; Supplier: LCSC; Features: Active braking function；Interleaved conduction protection；Current sensing/regulation function
U12-U23 = TPD1E10B06DPYR_C48260: LCSC Part Name: 双向 5.5V 6A@8/20us; Supplier Part: C48260; Manufacturer: TI(德州仪器); Supplier Footprint: X1-SON-2(0.6x1); JLCPCB Part Class: Extended Part; Datasheet: https://www.ti.com/cn/lit/ds/symlink/tpd1e10b06.pdf; Supplier: LCSC; Polarity: Bidirectional; Reverse Stand-Off Voltage (Vrwm): 5.5V; Clamping Voltage: 14V; Peak Pulse Current (Ipp): 6A@8/20us; Peak Pulse Power Dissipation (Ppp): 90W@8/20us; Voltage - Breakdown: 6V; Reverse Leakage Current (Ir): 100nA; Number of Channels: 1; Operating Temperature: -40℃~+125℃; level of protection: IEC 61000-4-2; Type: ESD; Junction Capacitance: 12pF
L1 = SPH4018H2R2MT: LCSC Part Name: 2.2uH ±20% 3A; Supplier Part: C370436; Manufacturer: Sunlord(顺络); Supplier Footprint: SMD,4x4mm; JLCPCB Part Class: Extended Part; Datasheet: https://item.szlcsc.com/datasheet/SPH4018H2R2MT/344187.html; Supplier: LCSC; Tolerance: ±20%; Current Rating: 2.2A; Current - Saturation(Isat): 3A; DC Resistance(DCR): 42mΩ
R32 R33 = 0603WAF5101T5E: LCSC Part Name: 5.1kΩ ±1% 100mW 厚膜电阻; Supplier Part: C23186; Manufacturer: UNI-ROYAL(厚声); Supplier Footprint: 0603; JLCPCB Part Class: Basic Part; Datasheet: https://item.szlcsc.com/datasheet/0603WAF5101T5E/23913.html; Supplier: LCSC; Type: Thick Film Resistor; Tolerance: ±1%; Power(Watts): 100mW; Voltage-Supply(Max): 75V; Temperature Coefficient: ±100ppm/℃; Operating Temperature: -55℃~+155℃
R34 = 0603WAF2372T5E: LCSC Part Name: 厚膜电阻 23.7kΩ ±1%; Supplier Part: C22912; Manufacturer: UNI-ROYAL(厚声); Supplier Footprint: 0603; JLCPCB Part Class: Extended Part; Datasheet: https://item.szlcsc.com/datasheet/0603WAF2372T5E/23639.html; Supplier: LCSC; Type: Thick Film Resistor; Tolerance: ±1%; Power(Watts): 100mW; Voltage-Supply(Max): 75V; Temperature Coefficient: ±100ppm/℃; Operating Temperature: -55℃~+155℃
R35 = RC0603FR-07453KL: LCSC Part Name: 厚膜电阻 453kΩ ±1% 100mW; Supplier Part: C273765; Manufacturer: YAGEO(国巨); Supplier Footprint: 0603; Datasheet: https://atta.szlcsc.com/upload/public/pdf/source/20191125/C364360_EA870FADD46A2AD4DBE56DD50D360B3E.pdf; Supplier: LCSC; Type: Thick Film Resistors; Tolerance: ±1%; Temperature Coefficient: ±100ppm/℃; Operating Temperature Range: -55℃~+155℃
U24 = TPS2553DBVR-1: LCSC Part Name: 精密可调、带电流限制的电源分配开关; Supplier Part: C111738; Manufacturer: TI(德州仪器); Supplier Footprint: SOT-23-6; JLCPCB Part Class: Extended Part; Datasheet: https://www.ti.com/cn/lit/gpn/tps2553-1; Supplier: LCSC; Type: High Side Switch; Number of Channels: 1; Control Input Logic: Active High; Maximum Continuous Current: 1.5A; Voltage - Supply: 2.5V~6.5V; RDS(on): 85mΩ; Operating Temperature	-: -40℃~+150℃; Features: Overtemperature protection (OTP)；Short-Circuit  Protection(SCP)；Overcurrent Protection(OCP)；Undervoltage Protection(UVP)
U25 = SY8089AAAC: LCSC Part Name: 降压型 2A 2.7V~5.5V; Supplier Part: C78988; Manufacturer: Silergy(矽力杰); Supplier Footprint: SOT-23-5; JLCPCB Part Class: Extended Part; Datasheet: https://item.szlcsc.com/datasheet/SY8089AAAC/80125.html; Supplier: LCSC; Function: Step-down type; Voltage - Supply: 2.7V~5.5V; Output Current: 2A; Frequency - Switching: 1MHz; Operating Temperature: -40℃~+85℃@(TA); Synchronous Rectifier: Yes; Number of Outputs: 1; Topology: Buck; Quiescent Current: 55uA; Switch tube (built-in/external): Built-in; Output Type: Adjustable; Features: Overcurrent Protection；Output discharge；Protection latch；Hiccup current limiting
U26 = AP2112K-3.3TRG1: LCSC Part Name: 3.3V 600mA 6V; Supplier Part: C51118; Manufacturer: DIODES(美台); Supplier Footprint: SOT-25-5; JLCPCB Part Class: Extended Part; Datasheet: https://item.szlcsc.com/datasheet/AP2112K-3.3TRG1/52131.html; Supplier: LCSC; Output Configuration: Positive; Voltage - Supply: 6V; Output Voltage: 3.3V; Output Current: 600mA; Power Supply Rejection Ratio (PSRR): 65dB@(1kHz); Voltage Dropout: 250mV@(600mA); standby current: 55uA; Noise: 50uVrms; Features: Enable control；Short Circuit Protection；Output discharge；Over Current Protection；Thermal shutdown; Operating Temperature: -40℃~+85℃@(Ta); Output Type: Fixed; Number of Outputs: 1
U27 = USBLC6-2SC6_C7519: LCSC Part Name: 单向ESD; Supplier Part: C7519; Manufacturer: ST(意法半导体); Supplier Footprint: SOT-23-6L; JLCPCB Part Class: Extended Part; Datasheet: https://item.szlcsc.com/datasheet/USBLC6-2SC6/7996.html; Supplier: LCSC; Polarity: Unidirectional; Reverse Stand-Off Voltage (Vrwm): 5.25V; Clamping Voltage: 17V; Peak Pulse Current (Ipp): 5A; Voltage - Breakdown: 6V; Reverse Leakage Current (Ir): 150nA; Number of Channels: 2; Operating Temperature: -40℃~+125℃; level of protection: IEC 61000-4-2; Type: ESD; Junction Capacitance: 3.5pF
USBC1 = TYPE-C-31-M-12: LCSC Part Name: Type-C 母 卧贴; Supplier Part: C165948; Manufacturer: 韩国韩荣; Supplier Footprint: SMD; JLCPCB Part Class: Extended Part; Datasheet: https://item.szlcsc.com/datasheet/TYPE-C-31-M-12/177331.html; Supplier: LCSC; Connector Type: Type-C; Gender: Female; Mounting Type: Surface Mount, Right Angle; Number of Contacts: 16P; Number of Ports: 1; Current Rating-Power: 5A; Voltage Rating: 20V; Connect-Disconnect Life: 10,000 cycles; Length: 7.35mm; Operating Temperature: -30℃~+80℃

## Nets
3V3_ANALOG: C2.1 C7.2 C35.1 C36.2 L2.1 R6.2 R11.1 TP-3v3Analog.1 U1.5(VS) U5.5(V+)
3V3_EXT: D2.1 J1.1 R22.1
3V3_LOGIC: C5.1 C14.2 C15.2 C17.1 C18.2 C37.2 C38.2 J8.2 J9.2 L1.1 L2.2 R3.2 R16.1 R21.2 R22.2 R23.2 R24.2 R25.2 R35.1 R37.1 R38.2 TP-3v3Logic.1 U2.2(D) U2.7(S#D) U2.8(VCC) U6.2(3V3) U7.5(VCC) U28.24(VCC)
3V3_MOTOR: C21.2 C22.2 C25.2 C26.2 C29.2 C30.2 R2.2 TP-3v3Motor.1 U1.4(IN-) U9.12(VM) U10.12(VM) U11.12(VM)
3V3_MOTOR_REG: C39.2 C40.2 C41.2 R2.1 U1.3(IN+) U26.5(VOUT)
GND: BOOT.1 BOOT.2 C1.1 C2.2 C3.2 C5.2 C6.1 C7.1 C9.1 C11.2 C14.1 C15.1 C16.1 C17.2 C18.1 C21.1 C22.1 C25.1 C26.1 C29.1 C30.1 C31.1 C32.1 C33.1 C34.1 C35.2 C36.1 C37.1 C38.1 C39.1 C40.1 C41.1 D1.2 D2.2 J1.3 J8.1 J9.1 Q1.2(S) R5.1 R7.1 R12.2 R26.1 R27.1 R28.1 R29.1 R30.1 R31.1 R32.2 R33.2 R34.2 R36.2 RESET.1 RESET.2 RSA1.1 RSA2.1 RSA3.1 RSB1.1 RSB2.1 RSB3.1 U1.2(GND) U2.4(GND) U3.4(GND) U5.2(V-) U6.1(GND) U6.40(GND) U6.41(GND) U7.3(GND) U9.13(GND) U9.17(EP) U10.13(GND) U10.17(EP) U11.13(GND) U11.17(EP) U12.2 U13.2 U14.2 U15.2 U16.2 U17.2 U18.2 U19.2 U20.2 U21.2 U22.2 U23.2 U24.2(GND) U25.2(GND) U26.2(GND) U27.2 U28.12(GND) USBC1.1(EH) USBC1.2(EH) USBC1.3(EH) USBC1.4(EH) USBC1.A1B12(GND) USBC1.B1A12(GND)
VBUS_PROTECTED: C11.1 C32.2 C33.2 C34.2 TP-VBUS_PROTECTED.1 U3.8(VCC+) U24.6(OUT) U25.1(EN) U25.4(IN) U26.1(VIN) U26.3(EN)
VBUS_RAW: C31.2 TP-VBUS_RAW.1 U24.1(IN) U24.3(EN) U27.5 USBC1.A4B9(VBUS) USBC1.B4A9(VBUS)
ADC_CURRENT: C1.2 R1.1 TP2.1 U6.38(IO2)
ADC_TACHO: R13.1 U6.39(IO1)
AISEN1: RSA1.2 U9.3(AISEN)
AISEN3: RSA2.2 U10.3(AISEN)
AISEN5: RSA3.2 U11.3(AISEN)
ARM_CLK: C4.1 Q1.3(D) R5.2 U2.1(CP)
ARM_EDGE_IN: C4.2 R4.1
BISEN2: RSB1.2 U9.6(BISEN)
BISEN4: RSB2.2 U10.6(BISEN)
BISEN6: RSB3.2 U11.6(BISEN)
BOOT_N: BOOT.3 BOOT.4 R25.1 U6.27(IO0)
COMM_TACHO_N: R15.2 R16.2 TP5.1 U3.7(2OUT) U6.31(IO38)
CURRENT_RAW: C8.2 R1.2 TP1.1 U1.1(OUT) U3.2(1IN-)
DECODER_INHIBIT: TP-Decoder-Inhibit.1 U7.4(Y) U28.1(LE) U28.23(E)
DRIVER_N_SLEEP: R31.2 U2.5(Q) U7.2(B) U9.1(nSLEEP) U10.1(nSLEEP) U11.1(nSLEEP)
ESP_EN: C16.2 R24.1 RESET.3 RESET.4 U6.3(EN)
FAULT_N_RAW: C3.1 R3.1 U2.6(R#D) U3.1(1OUT) U9.8(nFAULT) U10.8(nFAULT) U11.8(nFAULT) U24.4(FAULT#)
FLIM_REF: C6.2 R6.1 R7.2 U3.3(1IN+)
FWD1: U9.16(AIN1) U28.4(Q7)
FWD2: U9.9(BIN1) U28.7(Q4)
FWD3: U10.16(AIN1) U28.13(Q13)
FWD4: U10.9(BIN1) U28.16(Q14)
FWD5: U11.16(AIN1) U28.17(Q9)
FWD6: U11.9(BIN1) U28.20(Q10)
I2C_SCL: J8.3 R37.2 U6.24(IO47)
I2C_SDA: J8.4 R38.1 U6.23(IO21)
LATCH_ARM: R4.2 U6.10(IO17)
LATCH_STATE: U2.3(Q#) U6.9(IO16)
LOGIC_FB: R35.2 R36.1 U25.5(FB)
LOGIC_SW: L1.2 U25.3(LX)
MOTOR_1A: L3.1 U9.2(AOUT1)
MOTOR_1A_J: J2.1 L3.2 U12.1
MOTOR_1B: L4.1 U9.4(AOUT2)
MOTOR_1B_J: J2.3 L4.2 U13.1
MOTOR_2A: L5.1 U9.7(BOUT1)
MOTOR_2A_J: J3.1 L5.2 U14.1
MOTOR_2B: L6.1 U9.5(BOUT2)
MOTOR_2B_J: J3.3 L6.2 U15.1
MOTOR_3A: L7.1 U10.2(AOUT1)
MOTOR_3A_J: J4.1 L7.2 U16.1
MOTOR_3B: L8.1 U10.4(AOUT2)
MOTOR_3B_J: J4.3 L8.2 U17.1
MOTOR_4A: L9.1 U10.7(BOUT1)
MOTOR_4A_J: J5.1 L9.2 U18.1
MOTOR_4B: L10.1 U10.5(BOUT2)
MOTOR_4B_J: J5.3 L10.2 U19.1
MOTOR_5A: L11.1 U11.2(AOUT1)
MOTOR_5A_J: J6.1 L11.2 U20.1
MOTOR_5B: L12.1 U11.4(AOUT2)
MOTOR_5B_J: J6.3 L12.2 U21.1
MOTOR_6A: L13.1 U11.7(BOUT1)
MOTOR_6A_J: J7.1 L13.2 U22.1
MOTOR_6B: L14.1 U11.5(BOUT2)
MOTOR_6B_J: J7.3 L14.2 U23.1
MOTOR_ADDR0: R26.2 U6.20(IO12) U28.2(A0)
MOTOR_ADDR1: R27.2 U6.19(IO11) U28.3(A1)
MOTOR_ADDR2: R28.2 U6.22(IO14) U28.21(A2)
MOTOR_ADDR3: R29.2 U6.21(IO13) U28.22(A3)
MOTOR_ENABLE: Q1.1(G) R30.2 U6.11(IO18) U7.1(A)
ONEWIRE_BUS: D1.1 J1.2 R20.1 R21.1
ONEWIRE_MCU: R20.2 U6.12(IO8)
REV1: U9.15(AIN2) U28.5(Q6)
REV2: U9.10(BIN2) U28.6(Q5)
REV3: U10.15(AIN2) U28.14(Q12)
REV4: U10.10(BIN2) U28.15(Q15)
REV5: U11.15(AIN2) U28.18(Q8)
REV6: U11.10(BIN2) U28.19(Q11)
STATUS_LED_A: D3.1(A) R23.1
STATUS_LED_N: D3.2(K) U6.4(IO4)
TACHO_AC: C8.1 R9.1 U5.3(IN+)
TACHO_AMP: C10.2 R10.1 R13.2 R14.1 TP4.1 U5.1(OUT)
TACHO_CMP: R14.2 R15.1 U3.5(2IN+)
TACHO_FB: C10.1 R8.2 R10.2 U5.4(IN-)
TACHO_REF: C9.2 R8.1 R9.2 R11.2 R12.1 U3.6(2IN-)
UART_RX: R40.1 U6.36(RXD0)
UART_RX_DBG: J9.4 R40.2
UART_TX: R39.1 U6.37(TXD0)
UART_TX_DBG: J9.3 R39.2
USB_CC1: R33.1 USBC1.A5(CC1)
USB_CC2: R32.1 USBC1.B5(CC2)
USB_DM: U6.13(IO19) U27.6
USB_DN_IN: U27.1 USBC1.A7(DN1) USBC1.B7(DN2)
USB_DP: U6.14(IO20) U27.4
USB_DP_IN: U27.3 USBC1.A6(DP1) USBC1.B6(DP2)
USB_ILIM: R34.1 U24.5(ILIM)

Not connected (* = marked no-connect by the designer): J2 2* 4*; J3 2* 4*; J4 2* 4*; J5 2* 4*; J6 2* 4*; J7 2* 4*; U6 5(IO5)* 6(IO6)* 7(IO7)* 8(IO15)* 15(IO3)* 16(IO46)* 17(IO9)* 18(IO10)* 25(IO48)* 26(IO45)* 28(IO35)* 29(IO36)* 30(IO37)* 32(IO39)* 33(IO40)* 34(IO41)* 35(IO42)*; U9 11(NC)* 14(NC)*; U10 11(NC)* 14(NC)*; U11 11(NC)* 14(NC)*; U26 4(NC)*; U28 8(Q3)* 9(Q1)* 10(Q2)* 11(Q0)*; USBC1 A8(SBU1)* B8(SBU2)*

## Notes on the sheets
sheet 2
- Motor-control GPIOs avoid GPIO0/3/19/20/45/46; GPIO35-37 belong to the N8R8 octal PSRAM.
- GPIO5 samples the amplified commutation ripple: qualification evidence and a digital cross-check on COMM_TACHO_N.
- LE=E=DECODER_INHIBIT: address is transparent while off and immutable while driving.
- Only Q0..Q5 and Q8..Q13 are wired; invalid addresses 6/7 cannot energize a bridge.
- HARDWARE-LATCHED ONE-HOT MOTOR SELECTION
sheet 3
- 1R xISEN gives a 178..232 mA bridge ceiling: a board-protection backstop, ~4x above the 23..50 mA measured stall.
- xISEN is a production tuning parameter. 1.5R -> 119..155 mA sits just above the 100 mA firmware cap; do not
- narrow it before the section 3 current distributions exist, or the prototype clips the data it must collect.
- 1R xISEN gives a 178..232 mA bridge ceiling: a board-protection backstop, ~4x above the 23..50 mA measured stall.
- narrow it before the section 3 current distributions exist, or the prototype clips the data it must collect.
- xISEN is a production tuning parameter. 1.5R -> 119..155 mA sits just above the 100 mA firmware cap; do not
- 1R xISEN gives a 178..232 mA bridge ceiling: a board-protection backstop, ~4x above the 23..50 mA measured stall.
- xISEN is a production tuning parameter. 1.5R -> 119..155 mA sits just above the 100 mA firmware cap; do not
- narrow it before the section 3 current distributions exist, or the prototype clips the data it must collect.
sheet 5
- Calibrated Current / Persistent Fault / Independent Timeout
- INA180 gives 10 V/A. LMV393A senses CURRENT_RAW directly: nominal 280 mA trip with no filter delay.
  Tacho band-pass 1.6 Hz .. 339 Hz, gain ~85: matched to 20-40 Hz commutation, -43 dB at the 50 kHz chop.
